# Altium project New_Main_PCB.PrjPcb
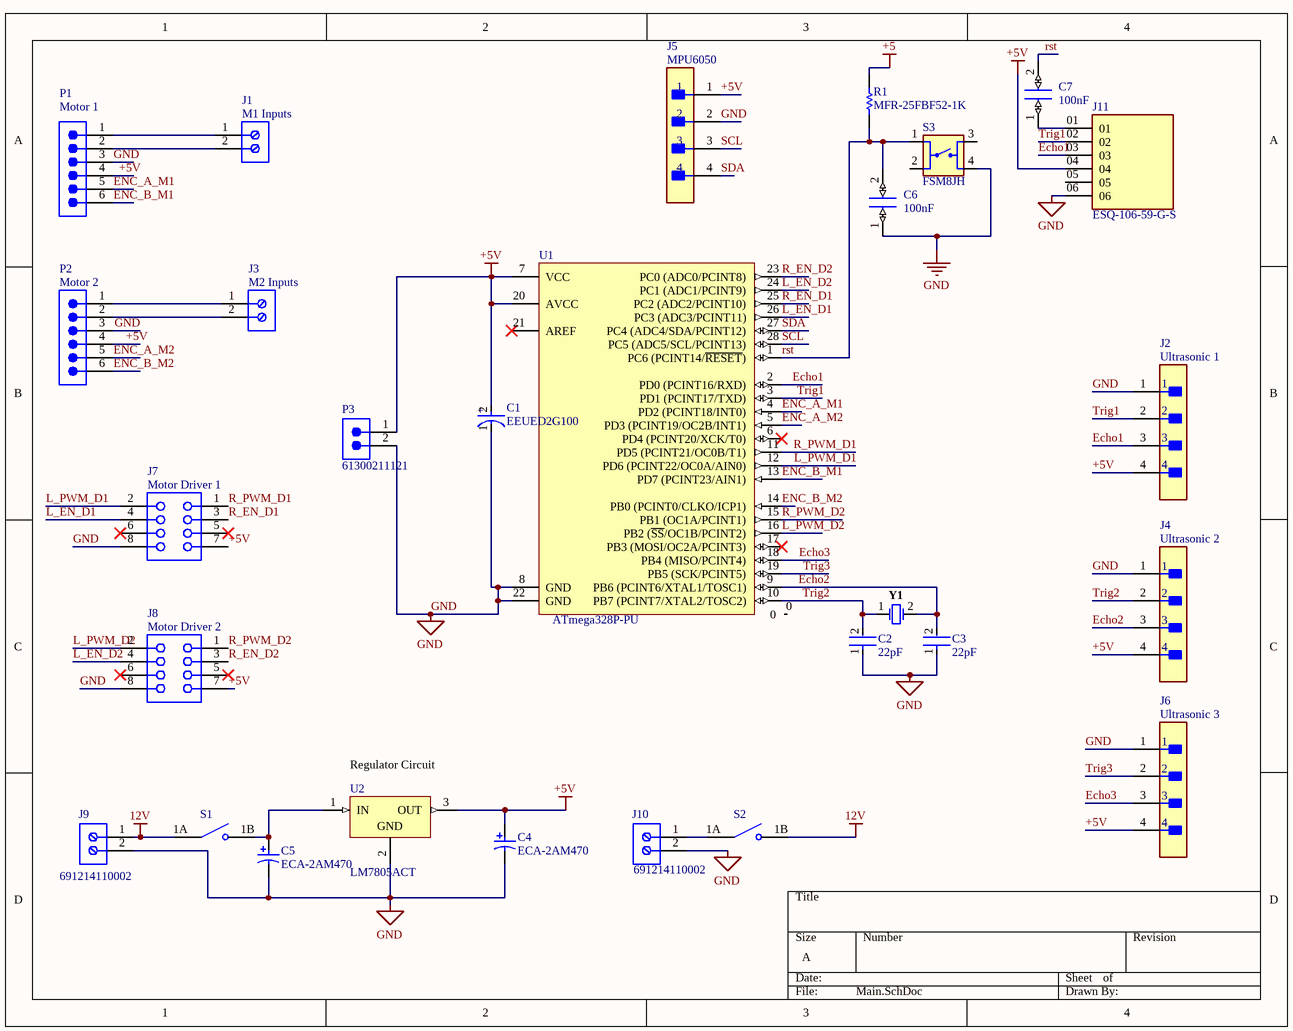
[diagram p0: Main.SchDoc]
1 sheet, 28 parts. Net scope: global (net labels, ports and power ports of the same name join across sheets).
Board file: PCB1.PcbDoc

## Sheet Main.SchDoc
size A; SheetNumber: 1; SheetTotal: 1

### Parts
C1  EEUED2G100  [FP-RAD-TH-D_10_0_5-L_20_2-MFG]
C2  Capacitance: 22pF  [FP-RDE0M1-MFG]  (hidden comment: RDE5C2A220J0M1H03A)
C3  Capacitance: 22pF  [FP-RDE0M1-MFG]  (hidden comment: RDE5C2A220J0M1H03A)
C4  ECA-2AM470  [CAPPR65-350-1150X800X1250]
C5  ECA-2AM470  [CAPPR65-350-1150X800X1250]
C6  value 100nF  [C320C]  (hidden comment: C320C104M5U5TA)
C7  value 100nF  [C320C]  (hidden comment: C320C104M5U5TA)
J1  691214110002  [691214110002]  (value not drawn)
J2  Ultrasonic 1  [FP-B4B-XH-A_LF_SN-MFG]
J3  691214110002  [691214110002]  (value not drawn)
J4  Ultrasonic 2  [FP-B4B-XH-A_LF_SN-MFG]
J5  MPU6050  [FP-M20-9990445-MFG]
J6  Ultrasonic 3  [FP-B4B-XH-A_LF_SN-MFG]
J7  Motor Driver 1  [SMTC-SSW-104-02-X-D]
J8  Motor Driver 2  [SMTC-SSW-104-02-X-D]
J9  691214110002  [691214110002]
J10  691214110002  [691214110002]
J11  ESQ-106-59-G-S  [SAMTEC_ESQ-106-59-G-S]
P1  Motor 1  [61300611121]
P2  Motor 2  [61300611121]
P3  61300211121  [61300211121]
R1  MFR-25FBF52-1K  [RESA60-630X240]
S1  DS01-254-L-01BE  [SW_DS01-254-L-01BE]  (value not drawn)
S2  DS01-254-L-01BE  [SW_DS01-254-L-01BE]  (value not drawn)
S3  FSM8JH  [SW_FSM8JH]
U1  ATmega328P-PU  [28P3]
U2  LM7805ACT  [FAIR-TO-220-3]
Y1  FOXSLF/160-20  [FOX-FOXSLF160-20]  (value not drawn)

### Nets
12V: J9.1 S1.1A(COM1) S2.1B(NO1)
+5: R1.1
+5V: C1.2(A) C4.1 J2.4 J4.4 J5.1 J6.4 J7.7 J8.7 J11.04 P1.4 P2.4 P3.1 U1.7(VCC) U1.20(AVCC) U2.3(OUT)
GND: C1.1(C) C2.1 C3.1 C4.2 C5.2 C6.1 J2.1 J4.1 J5.2 J6.1 J7.8 J8.8 J9.2 J10.2 J11.06 P1.3 P2.3 P3.2 S3.4 U1.8(GND) U1.22(GND) U2.2(GND)
Echo1: J2.3 J11.03 U1.2(PD0_(PCINT16/RXD))
Echo2: C3.2 J4.3 U1.9(PB6_(PCINT6/XTAL1/TOSC1)) Y1.2
Echo3: J6.3 U1.18(PB4_(MISO/PCINT4))
ENC_A_M1: P1.5 U1.4(PD2_(PCINT18/INT0))
ENC_A_M2: P2.5 U1.5(PD3_(PCINT19/OC2B/INT1))
ENC_B_M1: P1.6 U1.13(PD7_(PCINT23/AIN1))
ENC_B_M2: P2.6 U1.14(PB0_(PCINT0/CLKO/ICP1))
L_EN_D1: J7.4 U1.26(PC3_(ADC3/PCINT11))
L_EN_D2: J8.4 U1.24(PC1_(ADC1/PCINT9))
L_PWM_D1: J7.2 U1.12(PD6_(PCINT22/OC0A/AIN0))
L_PWM_D2: J8.2 U1.16(PB2_(~{SS}/OC1B/PCINT2))
R_EN_D1: J7.3 U1.25(PC2_(ADC2/PCINT10))
R_EN_D2: J8.3 U1.23(PC0_(ADC0/PCINT8))
R_PWM_D1: J7.1 U1.11(PD5_(PCINT21/OC0B/T1))
R_PWM_D2: J8.1 U1.15(PB1_(OC1A/PCINT1))
rst: C6.2 C7.2 R1.2 S3.1 U1.1(PC6_(PCINT14/~{RESET}))
SCL: J5.3 U1.28(PC5_(ADC5/SCL/PCINT13))
SDA: J5.4 U1.27(PC4_(ADC4/SDA/PCINT12))
Trig1: J2.2 J11.02 U1.3(PD1_(PCINT17/TXD))
Trig2: C2.2 J4.2 U1.10(PB7_(PCINT7/XTAL2/TOSC2)) Y1.1
Trig3: J6.2 U1.19(PB5_(SCK/PCINT5))
NetC5_1: C5.1 S1.1B(NO1) U2.1(IN)
NetC7_1: C7.1 J11.01
NetJ1_1: J1.1 P1.1
NetJ1_2: J1.2 P1.2
NetJ3_1: J3.1 P2.1
NetJ3_2: J3.2 P2.2
NetJ10_1: J10.1 S2.1A(COM1)

Not connected (* = marked no-connect by the designer): J7 5* 6*; J8 5* 6*; J11 05; S3 2 3; U1 0 6(PD4_(PCINT20/XCK/T0))* 17(PB3_(MOSI/OC2A/PCINT3))* 21(AREF)*

### Notes on the sheet
- (near J1) M1 Inputs
- (near J3) M2 Inputs
- (near U2) Regulator Circuit
- (in symbol CMP-05427-001613-1) +

### Library data of the parts
C1 = CMP-05427-001613-1: Aluminum Electrolytic Capacitors (Radial Lead Type) 10uF ±20% 400V; Lead Diameter: 0.6mm; Life (Hours): 8000Hour; Ripple Current (AC): 300mA; Dissipation Factor: 0.24%; Dielectric Material: Aluminium; Polarity: Polar; Voltage: 400V; Number of Pins: 2; Height: 20mm; Case/Package: Radial; REACH SVHC: No SVHC; Max Operating Temperature: 105°C; Construction: RADIAL; Voltage Rating (DC): 400V; Tolerance: 20%; Voltage Rating: 400V; Contact Plating: Tin; Ripple Current: 300mA; Min Operating Temperature: -25°C; Packaging: Bulk; Lead Free: Lead Free; Diameter: 10mm; Height - Seated (Max): 0.787inch; Radiation Hardening: No; Capacitance: 10uF; Termination: Radial; Length: 20mm; Series: ED; Package Quantity: 200; Mount: Through Hole; Lead Pitch: 5mm; RoHS Compliant: Yes
C2 C3 = CMP-06035-022985-1: Ceramic Capacitor 22pF ±5% 100V C0G Radial; Lead Diameter: 0.5mm; Mount: Through Hole; Min Operating Temperature: -55°C; Height: 3.5mm; Width: 0.098inch; Packaging: Cut Tape; Resistor Type: Ceramic; Case/Package: Radial; Voltage Rating: 100V; Height - Seated (Max): 0.236inch; Max Operating Temperature: 125°C; Dielectric: C0G; Package Quantity: 1; Voltage Rating (DC): 100V; Lead Free: Lead Free; Lead Pitch: 0.197inch; Termination: Radial; Tolerance: 5%; Length: 0.157inch
C4 C5 = CMP-1665-00041-1: Aluminum Electrolytic Capacitor, 47 uF, +/- 20%, 100 V, -40 to 85 degC, 2-Pin THD, RoHS, Bulk; Data Rate: 54 mbps; Nominal Supply Voltage: 3.3 V; Case\Package: QFN; ComponentLink1URL: http://www.panasonic.com/; Packaging: Tape and Reel; PackageDescription: 2-Pin Radial Lead, Dia 8 mm, Body Length 11.5 mm; PackageReference: CAPPR65-350-1150X800X1250; ComponentLink2Description: Datasheet; Max Operating Temperature: 70 degC; ComponentLink2URL: http://industrial.panasonic.com/cdbs/www-data/pdf/RDF0000/ABA0000C1047.pdf; RoHSCompliant: true; Length: 7.7 mm; Min Operating Temperature: -20 degC; DatasheetVersion: Mar-16; Mount: Surface Mount; Pins: 48; Radiation Hardening: No; Package Quantity: 500; ComponentLink1Description: Manufacturer URL
C6 C7 = C320C104M5U5TA: 0.1ÂµF Â±20% 50V Ceramic Capacitor Z5U Radial; MF: KEMET; Package: Radial KEMET; SnapEDA_Link: https://www.snapeda.com/parts/C320C104M5U5TA/KEMET/view-part/228184/?ref=snap; Price: None; MP: C320C104M5U5TA; Availability: Unavailable
J1 J3 J9 J10 = CMP-1502-02464-2: NexarPartId: 18818288; Plating: Brass, Steel; Current: 10A; Pitch: 3.5052mm; Number of Levels: 1; Number of Contacts: 2; Wire Gauge (Min): 16AWG; Voltage: 300V; Wire Gauge (Max): 24AWG; Stripping Length: -6mm; Number of Pins: 2; Number of Rows: 1; REACH SVHC: Unknown; RoHS: Compliant; Housing Material: Nylon; Termination: Screw; Mount: Through Hole; Contact Plating: Brass, Tin; Number of Positions Per Level: 2; Color: Blue, Green; Width: 7.9mm; Voltage Rating: 300V; Length: 7.4mm; Current Rating: 10A; Wire/Cable Gauge: 24AWG; Packaging: Box; Max Operating Temperature: 105°C; Lead Pitch: 3.5mm; Height: 8.7mm; Contact Material: Brass; Min Operating Temperature: -40°C
J2 J4 J6 = CMP-17439-000250-1: CONN HEADER VERT 4POS 2.5MM; Number of Contacts: 4; Contact Resistance: 20mR; Voltage Rating: 250V; Max Current Rating: 3A; Gender: Male; Wire/Cable Gauge: 22AWG; Mated Stacking Heights: 9.8mm; Insulation Resistance: 1GR; Orientation: Straight; Contact Type: Male Pin; Contact Finish - Mating: TIN; Series: XH; Max Voltage Rating (AC): 250V; Lead Pitch: 2.5mm; Contact Shape: Square; Insulation Color: Natural; Termination: Solder; Lead Free: Lead Free; Voltage Rating (AC): 250V; Number of Rows: 1; Flammability Rating: UL94 V-0; Number of Positions: 4; Max Operating Temperature: 85°C; Package Quantity: 500; Mount: Through Hole; REACH SVHC: No SVHC; Connector Type: Header; Insulation Material: Nylon; Fastening Type: Detent; Min Operating Temperature: -25°C; Housing Color: White; Packaging: Bulk; Contact Plating: Tin; Contact Material: Brass; Max Voltage Rating (DC): 250V; Housing Material: Polyamide; Color: Natural; Material: Polyamide; Pitch: 2.5mm; Depth: 5.75mm; Current Rating: 3A; Length: 12.4mm
J5 = CMP-00671-05399696-1: M20-9990445 Conn Unshrouded Header HDR 4 POS 2.54mm Solder ST Thru-Hole Bulk/Loose; Insulation Resistance: 10GΩ; Connector Type: Male Pin; Voltage Rating (DC): 750V; Max Current Rating: 3A; Contact Resistance: 25mΩ; Number of Contacts: 4; Gender: Male; Color: Black; Height: 2.54mm; Contact Material: Brass, Bronze, Gold, Nickel; Orientation: Straight; Width: 12.7mm; Mount: Through Hole; Pitch: 2.54mm; Lead Pitch: 2.54mm; RoHS: Compliant; Max Operating Temperature: 105°C; Case/Package: SIL; NexarPartId: 5399696; Depth: 2.54mm; Length: 10.16mm; Current Rating: 3A; Contact Plating: Gold; Radiation Hardening: No; Contact Mating Length: 6.096mm; Voltage Rating (AC): 750V; Termination: Solder; REACH SVHC: No SVHC; Weight: 45.359237g; Number of Rows: 1; Min Operating Temperature: -40°C; Housing Material: Nylon; Housing Color: Black; Number of Positions: 4; Number of Pins: 4
J7 J8 = CMP-1023-00343-1: SQ Post Socket, Through-hole, Vertical, -55 to 125 degC, 2.54mm Pitch, 8-Pin, Female, RoHS; Manufacturer: Samtec; PartNumber: SSW-104-02-G-D; Mounting Technology: Through-hole; ComponentLink1Description: Manufacturer URL; Orientation: Vertical; Pitch: 2.54 mm; ComponentLink2URL: http://www.samtec.com/documents/webfiles/pdf/SSW_TH.PDF; PackageReference: SSW-104-02-X-D; ComponentLink3Description: Package Specification; PackageVersion: CA, 6/1987; PackageDescription: Assembly, Socket Strip .016 X .031 Tail; ComponentLink2Description: Datasheet; RoHS: True; ComponentLink1URL: http://www.samtec.com; ComponentLink3URL: http://www.samtec.com/documents/webfiles/cpdf/SSW-1XX-XX-XXX-X-XX-XXX-XX-MKT.pdf; DatasheetVersion: F-214; Temperature Range: -55 to 125 degC
P1 P2 = CMP-1502-01070-3: NexarPartId: 20084590; Current Rating: 3A; Pitch: 2.54mm; Gender: Male; Operating Supply Voltage: 250V; Connector Type: Male Pin; Number of Positions: 6; Contact Resistance: 20mΩ; Packaging: Bulk; Number of Pins: 6; Number of Rows: 1; Contact Plating: Gold; Lead Free: Lead Free; RoHS: Compliant; Contact Mating Length: 5.9944mm; Voltage Rating: 250V; REACH SVHC: Unknown; Contact Gender: Male; Housing Material: PBT; Min Operating Temperature: -40°C; Lead Pitch: 2.54mm; Mount: Through Hole; Number of Contacts: 6; Max Operating Temperature: 105°C; Contact Material: Copper; Orientation: Vertical; Termination: Through Hole; Color: Black; Height: 8.89mm
P3 = CMP-1712-00002-6: NexarPartId: 20081794; Number of Contacts: 2; Pitch: 2.54mm; Connector Type: Male Pin; Voltage Rating: 250V; Current Rating: 3A; Gender: Male; Contact Resistance: 20mΩ; Height: 8.94mm; Lead Free: Lead Free; Number of Pins: 2; Termination: Through Hole; RoHS: Compliant; Lead Pitch: 2.54mm; REACH SVHC: No SVHC; Housing Material: PBT; Contact Mating Length: 5.9944mm; Min Operating Temperature: -40°C; Orientation: Vertical; Contact Material: Copper; Contact Gender: Male; Max Operating Temperature: 125°C; Number of Rows: 1; Number of Positions: 2; Packaging: Bulk; Contact Plating: Gold; Mount: Through Hole; Color: Black; Operating Supply Voltage: 250V
R1 = CMP-1659-00075-1: Axial Resistor, 1 KOhm, +/- 1%, 250 mW, -55 to 155 degC, 2-Pin THD, RoHS, Bulk; Voltage Rating: 250 V; Resistance: 10 kohm; Power Rating: 250 mW; ComponentLink2Description: Datasheet; RoHSCompliant: true; PackageReference: MFR-25; Case\Package: Axial; Max Operating Temperature: 155 degC; DatasheetVersion: Apr-13; Tolerance: 1%; ComponentLink1URL: http://www.yageo.com/; Length: 0.248 inch; ComponentLink2URL: http://www.yageo.com/documents/recent/Yageo%20LR_MFR_2013.pdf; Packaging: Bulk; Package Quantity: 200; PackageDescription: 2-Pin Axial Lead, Dia 2.4 mm, Body Length 6.3 mm; Min Operating Temperature: -55 degC; ComponentLink1Description: Manufacturer URL
S1 S2 = DS01-254-L-01BE: 1 Position, Through Hole, 2.54 mm Pitch, Raised Slide Actuator, Flat Bottom, Long Pin, DIP Switch; MF: CUI Devices; Check_prices: https://www.snapeda.com/parts/DS01-254-L-01BE/CUI+Devices/view-part/?ref=eda; CUI_purchase_URL: https://www.cuidevices.com/product/switches/dip-switches/ds01-254-series?utm_source=snapeda.com&utm_medium=referral&utm_campaign=snapedaBOM; Package: None; Purchase-URL: https://pricing.snapeda.com/search/part/DS01-254-L-01BE/?ref=eda; MP: DS01-254-L-01BE; Value: *; SnapEDA_Link: https://www.snapeda.com/parts/DS01-254-L-01BE/CUI+Devices/view-part/?ref=snap; Availability: In Stock; Price: None
S3 = FSM8JH: Tactile Switch SPST-NO Top Actuated Through Hole; MF: TE Connectivity; Check_prices: https://www.snapeda.com/parts/FSM8JH/TE+Connectivity+ALCOSWITCH+Switches/view-part/?ref=eda; Value: *; Availability: In Stock; MP: FSM8JH; Price: None; Package: None; SnapEDA_Link: https://www.snapeda.com/parts/FSM8JH/TE+Connectivity+ALCOSWITCH+Switches/view-part/?ref=snap
U1 = CMP-0095-00013-2: 8-bit AVR Microcontroller, 32KB Flash, 1KB EEPROM, 2KB SRAM, 28-pin PDIP, Industrial Grade (-40°C to 85°C); RevisionNote: DatasheetVersion updated. URLs added.; PackageVersion: revB, Sep-2001; PackageDescription: 28-lead (0.300"/7.62mm Wide) Plastic Dual Inline Package (PDIP); DatasheetVersion: revD, May-2011; ComponentLink1Description: Manufacturer URL; ComponentLink1URL: http://www.atmel.com/; PackageReference: 28P3; ComponentLink2Description: ATmega48A/48PA/88A/88PA/168A/168PA/328/328P Datasheet; ComponentLink3URL: http://www.atmel.com/dyn/resources/prod_documents/8271S.pdf; ComponentLink2URL: http://www.atmel.com/dyn/resources/prod_documents/8271.pdf; ComponentLink3Description: ATmega48A/48PA/88A/88PA/168A/168PA/328/328P Summary
U2 = CMP-2000-04937-1: Positive Voltage Regulator, 5 V, 1 A, 0 to 125 degC, 3-Pin TO-220, RoHS, Tube; Manufacturer: Fairchild; Number of Outputs: 1; Typical Dropout Voltage @ Current: 2V@1A; Output Type: Fixed; Output Voltage: 5V; Quiescent Current: 6mA; Dropout Voltage Measurement Current: 1A; Line Regulation: 50mV; Maximum Input Voltage: 35V; Regulator Function: Linear; Load Regulation: 100mV; Package Type: TO-220; Mounting Type: ThroughHole; Height: 16.51mm; Maximum Operating Temperature: +125degC; Datasheet Version: Rev. 1.0.1, 05/2006; Package Reference: TO-220; Minimum Operating Temperature: 0degC; Manufacturer URL: https://www.fairchildsemi.com/; Package URL: https://www.fairchildsemi.com/package-drawings/TO/TO220B03.pdf; Length: 10.67mm; Series: LM78xx; Dimensions: 10.67x4.83x16.51mm; Polarity: Positive; Maximum Output Current: 1A; Pin Count: 3; Width: 4.83mm; Package Description: 3-Pin Through Hole Device, Body 10 x 4.5 mm, Pitch 2.54 mm; Datasheet URL: https://datasheet.ciiva.com/5816/1359194-5816420.pdf
Y1 = CMP-1749-00003-1: Resistance Weld Thru-Hole Crystal, 16 MHz, -20 to 70 degC, 2-Pin THD, RoHS, Bulk; Voltage Rating: 250 V; Tolerance: 1%; Resistance: 221 kohm; Case\Package: Axial; Power Rating: 250 mW; RoHSCompliant: true; Package Quantity: 200; Packaging: Bulk; Min Operating Temperature: -55 degC; DatasheetVersion: Mar-15; ComponentLink1URL: http://www.foxonline.com/; Max Operating Temperature: 155 degC; PackageReference: FOXSLF160-20; Mount: Through Hole; PackageDescription: 2-Pin Through Hole Device, Body 11.35 x 4.65 mm; ComponentLink1Description: Manufacturer URL; ComponentLink2URL: http://www.foxonline.com/pdfs/hc49slf.pdf; ComponentLink2Description: Datasheet; Length: 0.248 inch
J11 = ESQ-106-59-G-S: Value: *; Price: None; Availability: Unavailable; Package: None; MP: ESQ-106-59-G-S